# EAGLE design TDA7292 (EAGLE 7.4.0)
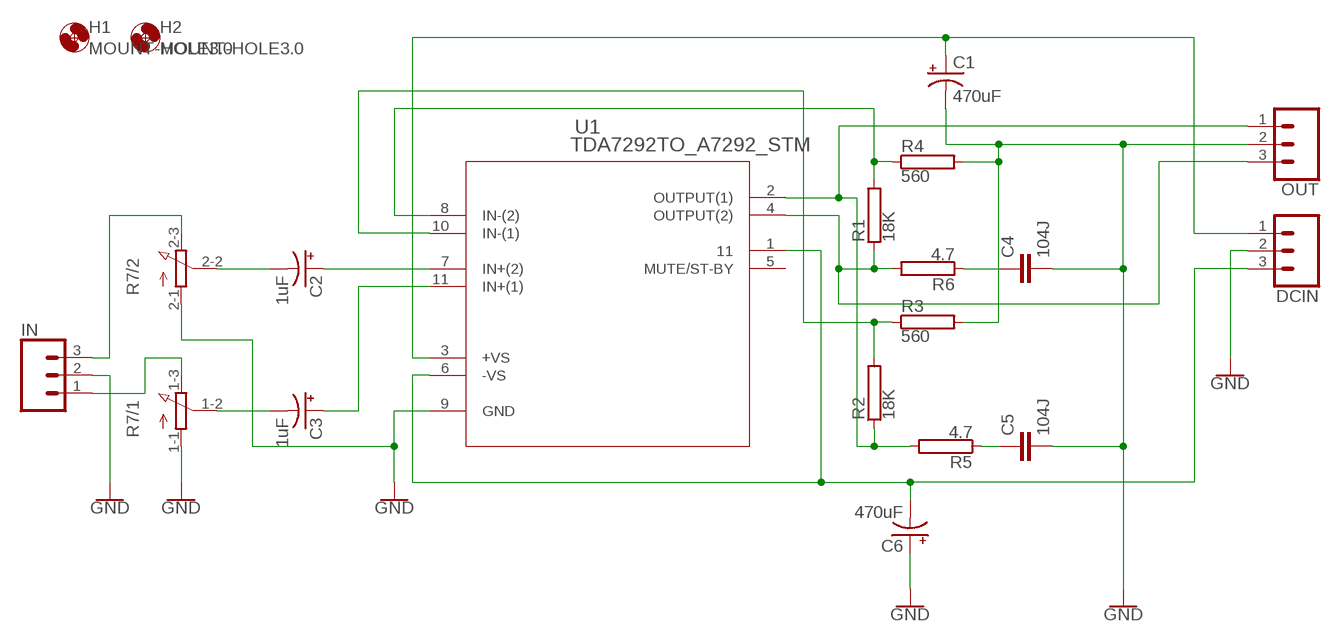
[diagram p0: schematic, sheet 1]

## Parts
C1  470uF  1000UF-RADIAL-5MM-25V-20%  [CPOL-RADIAL-5MM-10MM]
C2  1uF  1000UF-RADIAL-5MM-25V-20%  [CPOL-RADIAL-5MM-10MM]
C3  1uF  1000UF-RADIAL-5MM-25V-20%  [CPOL-RADIAL-5MM-10MM]
C4  104J  10NF-PTH-10MM-10000V-1-%  [CAP-PTH-10MM]
C5  104J  10NF-PTH-10MM-10000V-1-%  [CAP-PTH-10MM]
C6  470uF  1000UF-RADIAL-5MM-25V-20%  [CPOL-RADIAL-5MM-10MM]
DCIN  CONN_03POLAR  [MOLEX-1X3]
H1  MOUNT-HOLE3.0  [3,0]
H2  MOUNT-HOLE3.0  [3,0]
IN  CONN_03POLAR  [MOLEX-1X3]
OUT  CONN_03POLAR  [MOLEX-1X3]
R1  18K  RRS1/2  [RS1/2]
R2  18K  RRS1/2  [RS1/2]
R3  560  RRS1/2  [RS1/2]
R4  560  RRS1/2  [RS1/2]
R5  4.7  RRS1/2  [RS1/2]
R6  4.7  RRS1/2  [RS1/2]
R7  3RP/1610G  [3RP/1610G]
U1  TDA7292TO_A7292_STM  [TO_A7292_STM]

## Nets
GND: C1.- C4.2 C5.2 C6.+ DCIN.2 IN.2 OUT.2 R3.2 R4.2 R7.1-1(/1:A) R7.2-1(/2:A) U1.9(GND)
N$1: C6.- DCIN.3 U1.1 U1.6(-VS)
N$2: IN.1 R7.1-3(/1:E)
N$3: IN.3 R7.2-3(/2:E)
N$4: C3.- R7.1-2(/1:S)
N$5: C2.- R7.2-2(/2:S)
N$6: C2.+ U1.7(IN+(2))
N$7: C3.+ U1.11(IN+(1))
N$8: OUT.3 R1.1 R6.2 U1.4(OUTPUT(2))
N$11: R1.2 R4.1 U1.8(IN-(2))
N$12: C4.1 R6.1
N$13: OUT.1 R2.1 R5.2 U1.2(OUTPUT(1))
N$14: C5.1 R5.1
N$15: R2.2 R3.1 U1.10(IN-(1))
VTOP: C1.+ DCIN.1 U1.3(+VS)
Unconnected: U1.5(MUTE/ST-BY)

## Library data of the parts
C1-C3 C6 = SparkFun-Capacitors:1000UF: 1,000µF/1mF ceramic capacitors A capacitor is a passive two-terminal electrical component used to store electrical energy temporarily in an electric field. CAP-08070; PROD_ID: CAP-09538; VALUE: 1mF
C4 C5 = SparkFun-Capacitors:10NF: 0.01uF/10nF/10,000pF ceramic capacitors A capacitor is a passive two-terminal electrical component used to store electrical energy temporarily in an electric field. CAP-09321; PROD_ID: CAP-09321; VALUE: 10nF
DCIN IN OUT = SparkFun-Connectors:CONN_03: Multi connection point. Often used as Generic Header-pin footprint for 0.1 inch spaced/style header connections On any of the 0.1 inch spaced packages, you can populate with these: Break Away Headers - Straight <https://www.sparkfun.com/products/116> (PRT-00116) Break Away Male Headers - Right Angle <https://www.sparkfun.com/products/553> (PRT-00553) Female Headers <https://www.sparkfun.com/products/115> (PRT-00115) Break Away Headers - Machine Pin <https://www.sparkfun.com/products/117> (PRT-00117) Break Away Female Headers - Swiss Machine Pin <https://www.sparkfun.com/products/743> (PRT-00743) Stackable Header - 3 Pin (Female, 0.1") <https://www.sparkfun.com/products/13875> (PRT-13875) For SCREWTERMINALS and SPRING TERMINALS visit here: Screw Terimnals on SparkFun.com <https://www.sparkfun.com/search/results?term=Screw+Terminals> (5mm/3.5mm/2.54mm spacing) This device is also useful as a general connection point to wire up your design to another part of your project. Our various solder wires solder well into these plated through hole pads. Hook-Up Wire - Assortment (Stranded, 22 AWG) <https://www.sparkfun.com/products/11375> (PRT-11375) Hook-Up Wire - Assortment (Solid Core, 22 AWG) <https://www.sparkfun.com/products/11367> (PRT-11367) View the entire wire category on our website here <https://www.sparkfun.com/categories/141> Special notes: Molex polarized connector foot print use with SKU : PRT-08232 with associated crimp pins and housings.; PROD_ID: CONN-08625; SF_ID: PRT-08096
H1 H2 = holes:MOUNT-HOLE: MOUNTING HOLE with drill center marker
R1-R6 = resistor-power:R: Power Resitor; MF: OHMITE; MPN: RRS1K0E; OC_FARNELL: 1762006; OC_NEWARK: 64K5942
R7 = pot:3RP/1610G: 16mm Potentiometer two level Source: http://www.alphapotentiometers.net/html/16mm_pot_2.html
U1 = TDA7292-Ultralibrarian:TDA7292; COPYRIGHT: Copyright (C) 2022 Ultra Librarian. All rights reserved.; MANUFACTURER_PART_NUMBER: TDA7292; MFR_NAME: STMicroelectronics

## Net classes
0 default: clearance 0.205 mm

## Board
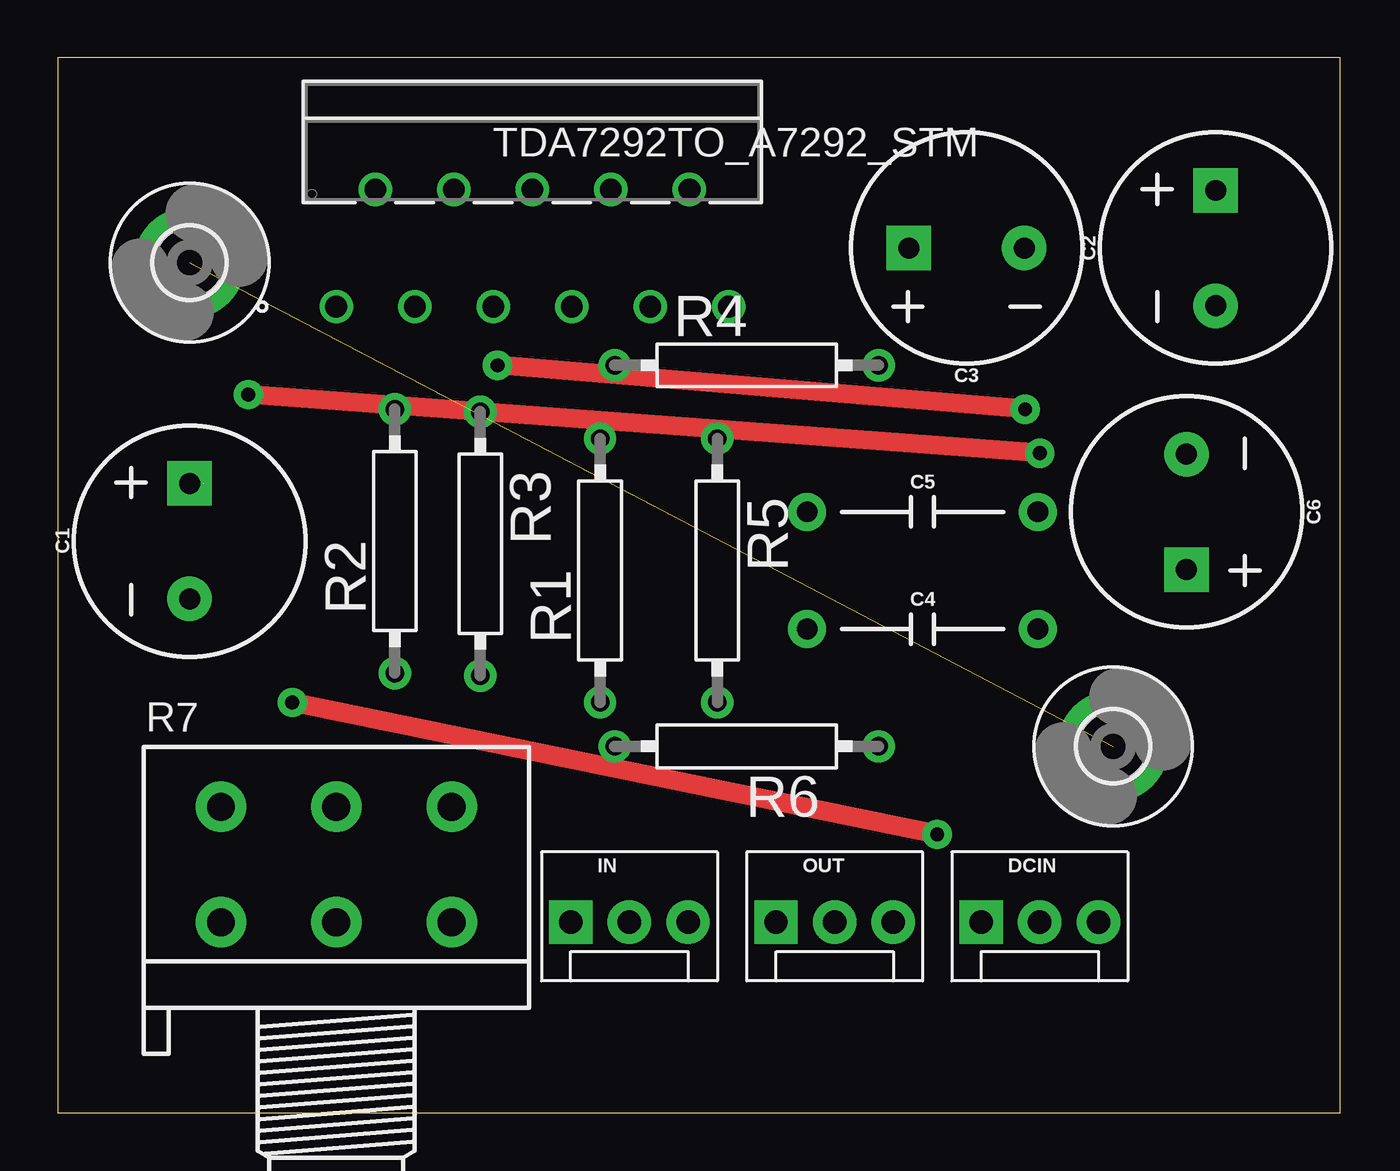
[diagram p1: board, top side]
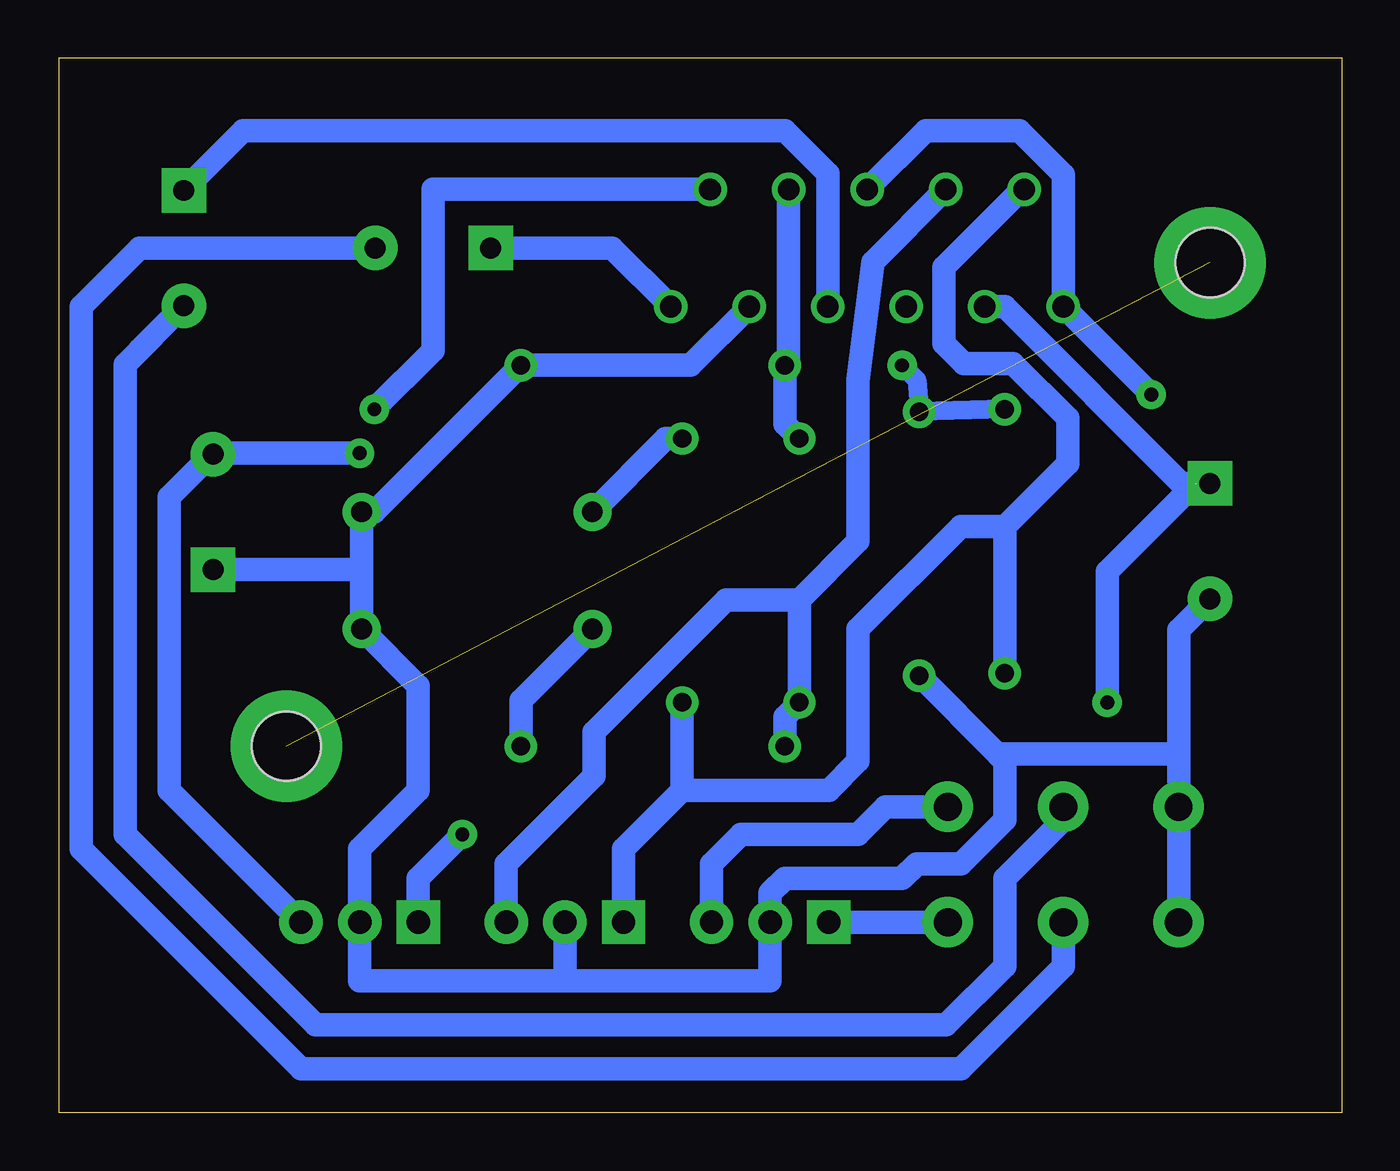
[diagram p2: board, bottom side, seen from below]

Size 55.55 x 45.71 mm. Coordinates in mm from the lower left corner, seen from the top.
Outline: 0,0 55.55,0 55.55,45.71 0,45.71 0,0
Copper layers (1*16): Top 0.035mm / dielectric 1.5mm / Bottom 0.035mm
Design rules "TDA7292": minimum track width 10mil, minimum drill 24mil, track to track 0.205mm, track to pad 0.205mm, pad to pad 0.205mm, via to via 0.205mm, smd to smd 8mil, copper to edge 40mil, drill to drill 8mil, minimum pad ring 10mil, minimum via ring 8mil, stop-mask expansion 4mil, vias tented up to drill 0mil, thermal gap 10mil

### Footprints (pad centres in the part's own frame; a part is rotated, then mirrored left to right if it is on the bottom)
CPOL-RADIAL-5MM-10MM = drill 0.9 pad 1.93 square: + 2.5,0 | drill 0.9 pad 1.93: - -2.5,0
CAP-PTH-10MM = drill 0.9 pad 1.651: 1 -5,0; 2 5,0
MOLEX-1X3 = drill 1.016 pad 1.88 square: 1 0,0 | drill 1.016 pad 1.88: 2 2.54,0; 3 5.08,0
3,0 = hole 3: 0,0
RS1/2 = drill 0.8 pad 1.4: 1 -5.715,0; 2 5.715,0
3RP/1610G = drill 1.2 pad 2.184: 1-1 -5,0; 1-2 0,0; 1-3 5,0; 2-1 -5,5; 2-2 0,5; 2-3 5,5
TO_A7292_STM = drill 0.94 pad 1.448: 1 0,0; 2 1.7,5.08; 3 3.4,0; 4 5.1,5.08; 5 6.8,0; 6 8.5,5.08; 7 10.2,0; 8 11.9,5.08; 9 13.6,0; 10 15.3,5.08; 11 17,0

### Placement (x,y rotation side)
C1  5.71,24.77 90 top
C2  50.16,37.47 90 top
C3  39.37,37.47 180 top
C4  37.47,20.95 0 top
C5  37.47,26.04 0 top
C6  48.9,26.04 270 top
DCIN  40.01,8.26 0 top
H1  5.71,36.83 0 top
H2  45.72,15.88 0 top
IN  22.23,8.26 0 top
OUT  31.11,8.26 0 top
R1  23.5,23.5 90 top
R2  14.61,24.77 90 top
R3  18.3,24.65 270 top
R4  29.84,32.38 0 top
R5  28.57,23.5 270 top
R6  29.84,15.88 180 top
R7  12.06,8.26 0 top
U1  12.06,34.92 0 top

### Tracks (layer width: path | path; a pad name or v marks a point on that pad's centre or on a via)
GND
  Bottom 1.016: U1.9 28.2,32.38 R4.2 41.91,26.04 C5.2 42.47,23.5 | 14.92,15.56 14.61,15.24 14.61,12.7 16.51,10.79 18.41,10.79 19.05,10.16 24.13,10.16 24.77,9.53 IN.2 24.77,5.71 33.66,5.71 | 14.92,15.56 R3.2 | C1.- 7.07,20.91 R7.2-1 | R7.1-1 R7.2-1 | R7.2-1 7.07,15.56 14.92,15.56 | OUT.2 33.66,5.71 | 33.66,5.71 42.55,5.71 DCIN.2 42.55,11.43 40.01,13.97 40.01,18.5 C4.2 42.47,23.5 | C6.+ 42.51,23.54 42.47,23.5
N$1  (via drill 0.6 pad 1.27)
  Top 0.813: v42.55,28.57 v8.26,31.11
  Bottom 0.813: 42.59,28.54 v42.55,28.57
  Bottom 1.016: DCIN.3 50.8,13.97 50.8,26.67 48.94,28.54 C6.- 48.85,28.57 v42.55,28.57 | v8.26,31.11 U1.1 12.06,40.64 13.97,42.55 18.02,42.55 U1.6
N$2
  Bottom 1.016: IN.1 R7.1-3
N$3
  Bottom 1.016: R7.2-3 19.77,13.26 20.95,12.06 26.04,12.06 27.3,10.79 IN.3
N$4
  Bottom 1.016: R7.1-2 12.06,6.35 16.51,1.91 45.09,1.91 54.61,11.43 54.61,34.92 52.07,37.47 C3.-
N$5
  Bottom 1.016: R7.2-2 12.06,12.7 14.61,10.16 14.61,6.35 17.14,3.81 44.45,3.81 52.7,12.06 52.7,32.42 C2.- 52.07,33.06
N$6
  Bottom 1.016: U1.7 22.27,40.68 24.13,42.55 47.59,42.55 C2.+
N$7
  Bottom 1.016: U1.11 31.61,37.47 C3.+
N$8
  Bottom 1.016: U1.4 20.32,36.85 20.32,36.83 20.95,31.75 20.95,24.77 23.5,22.23 | 23.5,22.23 R1.1 24.13,17.14 R6.2 | OUT.3 36.2,10.79 32.38,14.61 32.38,16.51 26.67,22.23 23.5,22.23
N$11
  Bottom 1.016: U1.8 23.96,32.55 R4.1 24.13,29.84 R1.2
N$12
  Bottom 1.016: R6.1 35.56,17.86 C4.1
N$13
  Bottom 1.016: R5.2 28.57,13.97 | OUT.1 31.11,11.43 28.57,13.97 | 28.57,13.97 22.23,13.97 20.95,15.24 20.95,20.95 16.51,25.4 14.61,25.4 | 14.61,25.4 11.88,28.13 11.88,30.11 14.24,32.47 16.37,32.47 17.23,33.33 17.23,36.63 13.86,40.01 U1.2 | 14.61,25.4 R2.1
N$14
  Bottom 1.016: R5.1 29.29,29.21 C5.1
N$15  (via drill 0.6 pad 1.27)
  Top 0.813: v41.91,30.48 v19.05,32.38
  Bottom 0.813: R2.2 R3.1 18.41,31.75 v19.05,32.38
  Bottom 1.016: U1.10 39.37,40.01 39.37,33.02 v41.91,30.48
VTOP  (via drill 0.6 pad 1.27)  (1 unrouted)
  Top 0.813: v38.1,12.06 v10.16,17.78
  Bottom 1.016: 6.31,27.27 C1.+ | v10.16,17.78 10.16,23.45 6.35,27.27 6.95,27.27 14.61,34.92 U1.3 | DCIN.1 40.01,10.16 v38.1,12.06
~_REAL_OUTLINEMILL_~  (via drill 3 pad 4.83)  (1 unrouted)
  other vias: 45.72,15.88 5.71,36.83